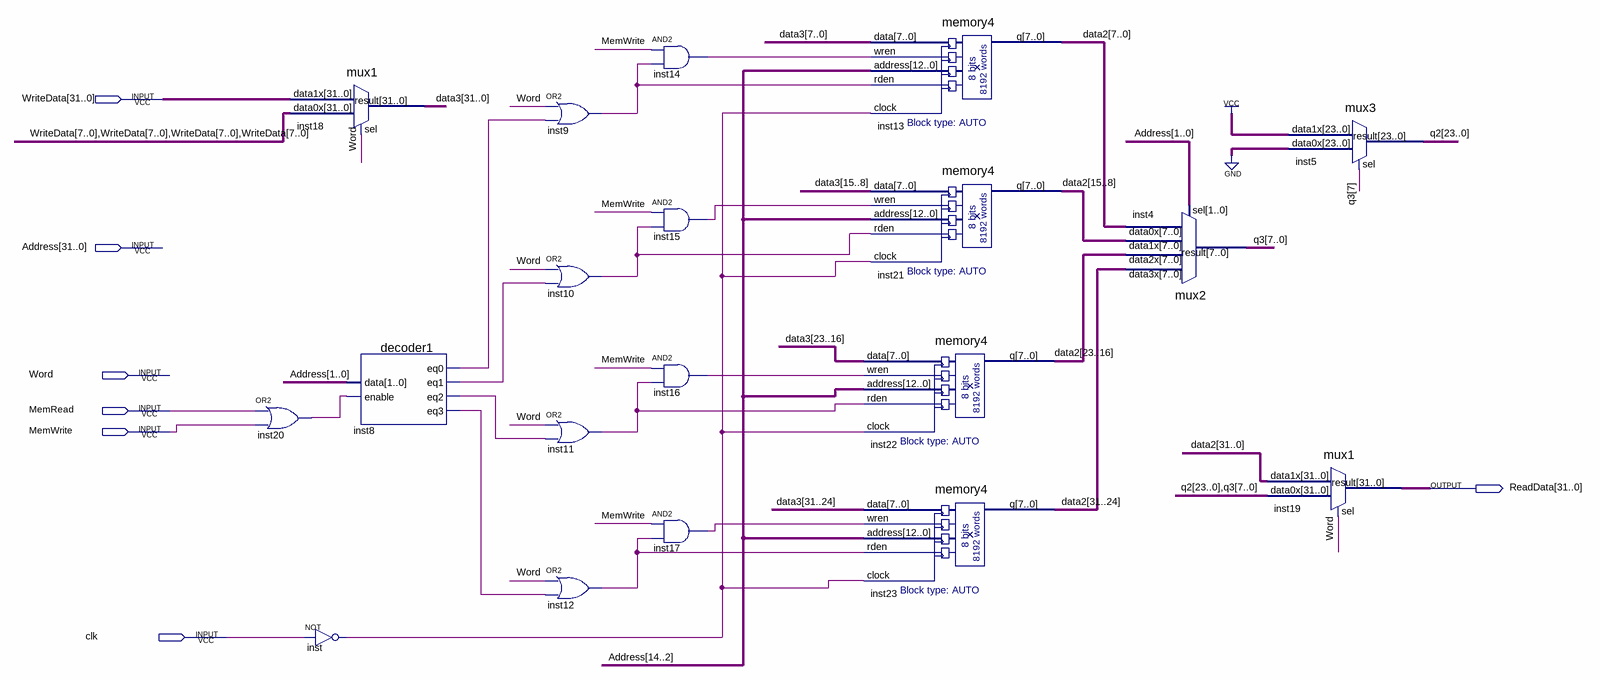
[diagram p0: schematic sheet]
// Quartus schematic memory_asli2.bdf as structural Verilog: 19 symbols, 7 pins
module memory_asli2 (
  input  [31:0] WriteData,
  input  [31:0] Address,
  input  Word,
  input  MemRead,
  input  MemWrite,
  input  clk,
  output [31:0] ReadData
);

  wire inst8_eq0, inst8_eq1, inst8_eq2, inst8_eq3, inst9_out, inst10_out, inst11_out, inst12_out, inst14_out,
       inst15_out, inst16_out, inst17_out, inst20_out, inst_out;
  wire [7:0] q3;
  wire [23:0] q2;
  wire [31:0] data2, data3;

  mux1 inst18 (
    .data1x(WriteData), .data0x({WriteData[7:0], WriteData[7:0], WriteData[7:0], WriteData[7:0]}),
    .sel(Word), .result(data3));
  or inst20 (inst20_out, MemRead, MemWrite);
  decoder1 inst8 (
    .data(Address[1:0]), .enable(inst20_out), .eq0(inst8_eq0), .eq1(inst8_eq1), .eq2(inst8_eq2),
    .eq3(inst8_eq3));
  not inst (inst_out, clk);
  or inst9 (inst9_out, Word, inst8_eq0);
  or inst10 (inst10_out, Word, inst8_eq1);
  or inst11 (inst11_out, Word, inst8_eq2);
  or inst12 (inst12_out, Word, inst8_eq3);
  and inst14 (inst14_out, MemWrite, inst9_out);
  and inst15 (inst15_out, MemWrite, inst10_out);
  and inst16 (inst16_out, MemWrite, inst11_out);
  and inst17 (inst17_out, MemWrite, inst12_out);
  memory4 inst13 (
    .data(data3[7:0]), .wren(inst14_out), .address(Address[14:2]), .rden(inst9_out), .clock(inst_out),
    .q(data2[7:0]));
  memory4 inst21 (
    .data(data3[15:8]), .wren(inst15_out), .address(Address[14:2]), .rden(inst10_out), .clock(inst_out),
    .q(data2[15:8]));
  memory4 inst22 (
    .data(data3[23:16]), .wren(inst16_out), .address(Address[14:2]), .rden(inst11_out), .clock(inst_out),
    .q(data2[23:16]));
  memory4 inst23 (
    .data(data3[31:24]), .wren(inst17_out), .address(Address[14:2]), .rden(inst12_out), .clock(inst_out),
    .q(data2[31:24]));
  mux2 inst4 (
    .data3x(data2[31:24]), .data2x(data2[23:16]), .data1x(data2[15:8]), .data0x(data2[7:0]),
    .sel(Address[1:0]), .result(q3));
  mux3 inst5 (.data1x({24{1'b1}}), .data0x({24{1'b0}}), .sel(q3[7]), .result(q2));
  mux1 inst19 (.data1x(data2), .data0x({q2, q3}), .sel(Word), .result(ReadData));
endmodule
